# Altium project mark3.PrjPcb
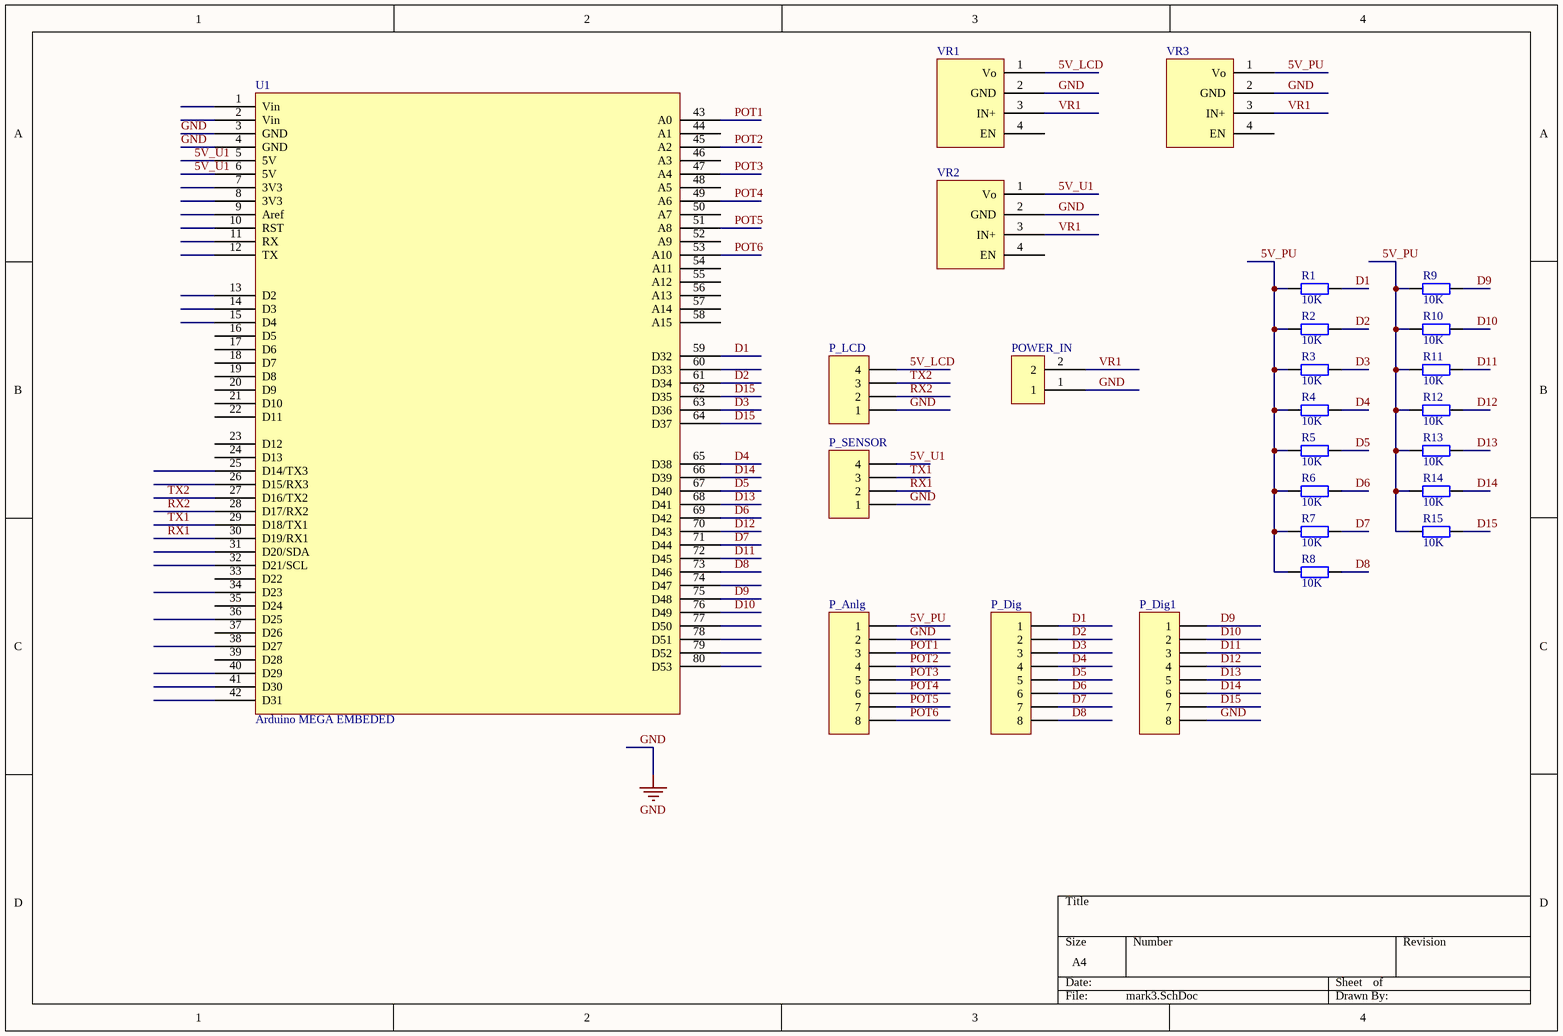
[diagram p0: mark3.SchDoc]
1 sheet, 25 parts. Net scope: global (net labels, ports and power ports of the same name join across sheets).
Board files: mark3_1.PcbDoc, mark3_2.PcbDoc

## Sheet mark3.SchDoc
size A4

### Parts
P_Anlg  Header 8  [TERM_8P_GREEN]  (value not drawn)
P_Dig  Header 8  [TERM_8P_GREEN]  (value not drawn)
P_Dig1  Header 8  [TERM_8P_GREEN]  (value not drawn)
P_LCD  MHDR1X4  [TERM_4P_GREEN]  (value not drawn)
P_SENSOR  MHDR1X4  [TERM_4P_GREEN]  (value not drawn)
POWER_IN  Term_2Pin_Green  [TERM_2P_GREEN]  (value not drawn)
R1  value 10K  [AXIAL-0.4]  (hidden comment: Res2)
R2  value 10K  [AXIAL-0.4]  (hidden comment: Res2)
R3  value 10K  [AXIAL-0.4]  (hidden comment: Res2)
R4  value 10K  [AXIAL-0.4]  (hidden comment: Res2)
R5  value 10K  [AXIAL-0.4]  (hidden comment: Res2)
R6  value 10K  [AXIAL-0.4]  (hidden comment: Res2)
R7  value 10K  [AXIAL-0.4]  (hidden comment: Res2)
R8  value 10K  [AXIAL-0.4]  (hidden comment: Res2)
R9  value 10K  [AXIAL-0.4]  (hidden comment: Res2)
R10  value 10K  [AXIAL-0.4]  (hidden comment: Res2)
R11  value 10K  [AXIAL-0.4]  (hidden comment: Res2)
R12  value 10K  [AXIAL-0.4]  (hidden comment: Res2)
R13  value 10K  [AXIAL-0.4]  (hidden comment: Res2)
R14  value 10K  [AXIAL-0.4]  (hidden comment: Res2)
R15  value 10K  [AXIAL-0.4]  (hidden comment: Res2)
U1  Arduino MEGA EMBEDED  [ARDUINOMEGA]
VR1  MODUL_LM2596_mini  [MODUL_LM2596_mini]  (value not drawn)
VR2  MODUL_LM2596_mini  [MODUL_LM2596_mini]  (value not drawn)
VR3  MODUL_LM2596_mini  [MODUL_LM2596_mini]  (value not drawn)

### Nets
GND: P_Anlg.2 P_Dig1.8 P_LCD.1 P_SENSOR.1 POWER_IN.1 U1.3(GND) U1.4(GND) VR1.2(GND) VR2.2(GND) VR3.2(GND)
5V_LCD: P_LCD.4 VR1.1(Vo)
5V_PU: P_Anlg.1 R1.2 R2.2 R3.2 R4.2 R5.2 R6.2 R7.2 R8.2 R9.2 R10.2 R11.2 R12.2 R13.2 R14.2 R15.2 VR3.1(Vo)
5V_U1: P_SENSOR.4 U1.5(5V) U1.6(5V) VR2.1(Vo)
D1: P_Dig.1 R1.1 U1.59(D32)
D2: P_Dig.2 R2.1 U1.61(D34)
D3: P_Dig.3 R3.1 U1.63(D36)
D4: P_Dig.4 R4.1 U1.65(D38)
D5: P_Dig.5 R5.1 U1.67(D40)
D6: P_Dig.6 R6.1 U1.69(D42)
D7: P_Dig.7 R7.1 U1.71(D44)
D8: P_Dig.8 R8.1 U1.73(D46)
D9: P_Dig1.1 R9.1 U1.75(D48)
D10: P_Dig1.2 R10.1 U1.76(D49)
D11: P_Dig1.3 R11.1 U1.72(D45)
D12: P_Dig1.4 R12.1 U1.70(D43)
D13: P_Dig1.5 R13.1 U1.68(D41)
D14: P_Dig1.6 R14.1 U1.66(D39)
D15: P_Dig1.7 R15.1 U1.62(D35) U1.64(D37)
POT1: P_Anlg.3 U1.43(A0)
POT2: P_Anlg.4 U1.45(A2)
POT3: P_Anlg.5 U1.47(A4)
POT4: P_Anlg.6 U1.49(A6)
POT5: P_Anlg.7 U1.51(A8)
POT6: P_Anlg.8 U1.53(A10)
RX1: P_SENSOR.2 U1.30(D19/RX1)
RX2: P_LCD.2 U1.28(D17/RX2)
TX1: P_SENSOR.3 U1.29(D18/TX1)
TX2: P_LCD.3 U1.27(D16/TX2)
VR1: POWER_IN.2 VR1.3(IN+) VR2.3(IN+) VR3.3(IN+)

Not connected (* = marked no-connect by the designer): U1 1(Vin) 2(Vin) 7(3V3) 8(3V3) 9(Aref) 10(RST) 11(RX) 12(TX) 13(D2) 14(D3) 15(D4) 16(D5) 17(D6) 18(D7) 19(D8) 20(D9) 21(D10) 22(D11) 23(D12) 24(D13) 25(D14/TX3) 26(D15/RX3) 31(D20/SDA) 32(D21/SCL) 33(D22) 34(D23) 35(D24) 36(D25) 37(D26) 38(D27) 39(D28) 40(D29) 41(D30) 42(D31) 44(A1) 46(A3) 48(A5) 50(A7) 52(A9) 54(A11) 55(A12) 56(A13) 57(A14) 58(A15) 60(D33) 74(D47) 77(D50) 78(D51) 79(D52) 80(D53); VR1 4(EN); VR2 4(EN); VR3 4(EN)

### Library data of the parts
P_Anlg P_Dig P_Dig1 = Header 8: Header, 8-Pin; LatestRevisionDate: 17-Jul-2002; LatestRevisionNote: Re-released for DXP Platform.; Publisher: Altium Limited
P_LCD P_SENSOR = MHDR1X4: Header, 4-Pin; LatestRevisionDate: 17-Jul-2002; LatestRevisionNote: Re-released for DXP Platform.; Publisher: Altium Limited
POWER_IN = Term_2Pin_Blck
R1-R15 = Res2: Resistor; Published: 8-Jun-2000; LatestRevisionDate: 17-Jul-2002; LatestRevisionNote: Re-released for DXP Platform.; PackageReference: AXIAL-0.4; Publisher: Altium Limited